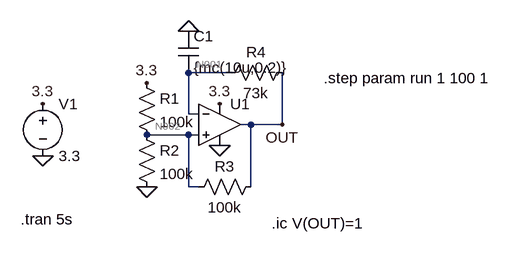
[diagram p0: schematic Draft2.asc]
Draft2.asc, the LTspice schematic file:
Version 4
SHEET 1 880 680
WIRE 240 96 176 96
WIRE 176 160 176 96
WIRE 192 160 176 160
WIRE 272 176 256 176
WIRE 320 176 320 96
WIRE 320 176 272 176
WIRE 176 192 112 192
WIRE 192 192 176 192
WIRE 176 272 176 192
WIRE 192 272 176 272
WIRE 272 272 272 176
FLAG -48 224 0
FLAG -48 144 3.3
FLAG 224 144 3.3
FLAG 224 208 0
FLAG 112 272 0
FLAG 112 112 3.3
FLAG 176 32 0
FLAG 320 176 OUT
SYMBOL Opamps\\UniversalOpamp2 224 176 R0
SYMATTR InstName U1
SYMBOL voltage -48 128 R0
WINDOW 123 0 0 Left 2
WINDOW 39 0 0 Left 2
SYMATTR InstName V1
SYMATTR Value 3.3
SYMBOL res 96 96 R0
SYMATTR InstName R1
SYMATTR Value 100k
SYMBOL res 96 176 R0
SYMATTR InstName R2
SYMATTR Value 100k
SYMBOL res 288 256 R90
WINDOW 0 0 56 VBottom 2
WINDOW 3 32 56 VTop 2
SYMATTR InstName R3
SYMATTR Value 100k
SYMATTR SpiceLine tol=1 pwr=0.1
SYMBOL cap 160 32 R0
SYMATTR InstName C1
SYMATTR Value {mc(10u,0.2)}
SYMBOL res 336 80 R90
WINDOW 0 0 56 VBottom 2
WINDOW 3 32 56 VTop 2
SYMATTR InstName R4
SYMATTR Value 73k
TEXT -82 322 Left 2 !.tran 5s
TEXT 304 328 Left 2 !.ic V(OUT)=1
TEXT 384 104 Left 2 !.step param run 1 100 1

The netlist it stands for:
* Draft2.asc
XU1 N002 N001 3.3 0 OUT level.2 Avol=1Meg GBW=10Meg Slew=10Meg ilimit=25m rail=0 Vos=0 phimargin=45 en=0 enk=0 in=0 ink=0 Rin=500Meg  ; pins IN+ IN- V+ V- OUT
V1 3.3 0 3.3
R1 3.3 N002 100k
R2 N002 0 100k
R3 OUT N002 100k tol=1 pwr=0.1
C1 0 N001 {mc(10u,0.2)}
R4 OUT N001 73k
.tran 5s
.ic V(OUT)=1
.step param run 1 100 1
.lib UniversalOpamps2.sub
.backanno
.end

* Results of the author's LTspice run, read from the files saved beside the schematic
* Operating Point (first step), zero values left out:
*   run = 1 
*   V(out) = 1 V
*   V(3.3) = 3.3 V
*   V(n001) = 1 V
*   V(n002) = 1.433 V
*   I(R4) = -1.3 nA
*   I(R3) = -4.333 µA
*   I(R2) = 14.33 µA
*   I(R1) = 18.67 µA
*   I(V1) = -25.02 mA
*   Ix(u1:1) = -433.3 pA
*   Ix(u1:2) = -1.3 nA
*   Ix(u1:3) = 25 mA
*   Ix(u1:4) = -150 nA
*   Ix(u1:5) = -25 mA